# EAGLE design chip (EAGLE 6.4)
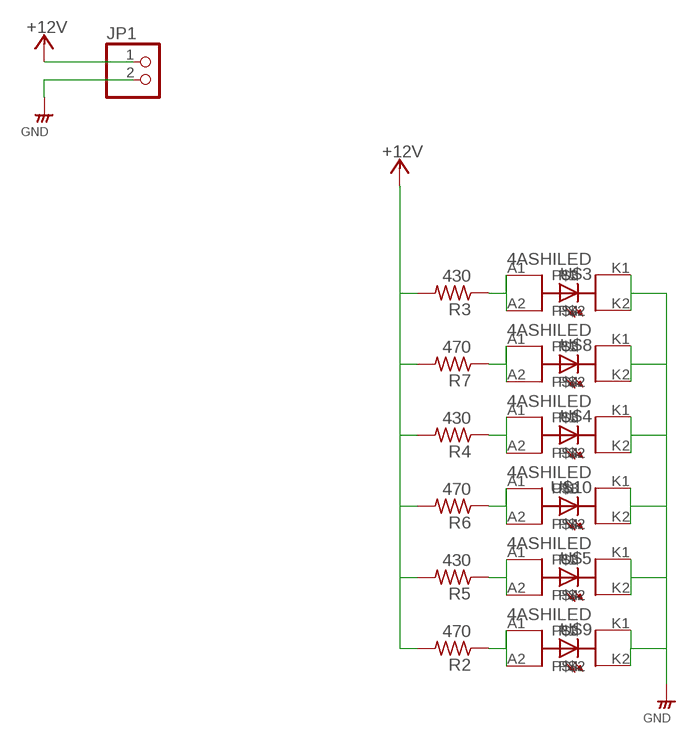
[diagram p0: schematic, sheet 1]

## Parts
JP1  PINHD-1X2"  [1*02]
R2  470  RESISTORS3216  [3216]
R3  430  RESISTORS3216  [3216]
R4  430  RESISTORS3216  [3216]
R5  430  RESISTORS3216  [3216]
R6  470  RESISTORS3216  [3216]
R7  470  RESISTORS3216  [3216]
U$3  4ASHILED  [4AHILED-KAI]
U$4  4ASHILED  [4AHILED-KAI]
U$5  4ASHILED  [4AHILED-KAI]
U$8  4ASHILED  [4AHILED-KAI]
U$9  4ASHILED  [4AHILED-KAI]
U$10  4ASHILED  [4AHILED-KAI]

## Nets
+12V: JP1.1 R2.2 R3.2 R4.2 R5.2 R6.2 R7.2
GND: JP1.2 U$3.K1 U$3.K2 U$4.K1 U$4.K2 U$5.K1 U$5.K2 U$8.K1 U$8.K2 U$9.K1 U$9.K2 U$10.K1 U$10.K2
N$1: R7.1 U$8.A1(P1) U$8.A2
N$2: R3.1 U$3.A1(P1) U$3.A2
N$4: R4.1 U$4.A1(P1) U$4.A2
N$6: R5.1 U$5.A1(P1) U$5.A2
N$7: R6.1 U$10.A1(P1) U$10.A2
N$9: R2.1 U$9.A1(P1) U$9.A2

## Library data of the parts
JP1 = pinhead_s:PINHD-1X2: PIN HEADER
R2-R7 = rcl__s:RESISTORS
U$3-U$5 U$8-U$10 = 4ashiLED-kai:4ASHILED

## Board
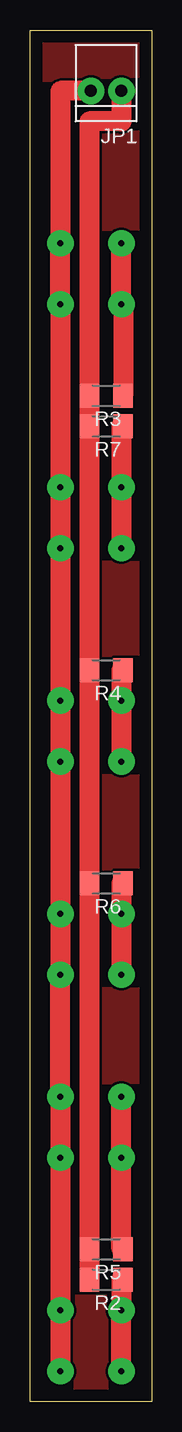
[diagram p1: board, top side]
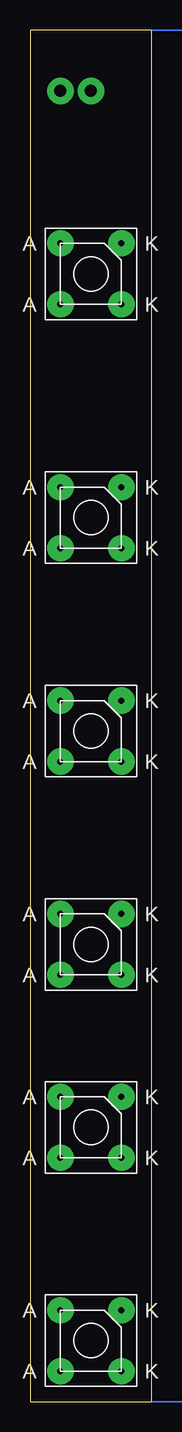
[diagram p2: board, bottom side, seen from below]

Size 10.16 x 114.3 mm. Coordinates in mm from the lower left corner, seen from the top.
Outline: 10.16,0 0,0 0,114.3 10.16,114.3 10.16,0
Copper layers (1*16): Top 0.035mm / dielectric 1.5mm / Bottom 0.035mm
Design rules "default": minimum track width 10mil, minimum drill 24mil, track to track 8mil, track to pad 8mil, pad to pad 8mil, via to via 8mil, smd to smd 8mil, copper to edge 40mil, drill to drill 8mil, minimum pad ring 10mil, minimum via ring 8mil, stop-mask expansion 4mil, vias tented up to drill 0mil, thermal gap 10mil

### Footprints (pad centres in the part's own frame; a part is rotated, then mirrored left to right if it is on the bottom)
1*02 = drill 1 pad 2.184: 1 -1.27,0; 2 1.27,0
3216 = smd 1.6 x 2: 1 -1.4,0; 2 1.4,0
4AHILED-KAI = drill 0.5 pad 2.184: A1 -2.54,2.54; A2 -2.54,-2.54; K1 2.54,2.54; K2 2.54,-2.54

### Placement (x,y rotation side)
JP1  6.35,109.22 180 top
R2  6.35,10.16 180 top
R3  6.35,83.82 180 top
R4  6.35,60.96 180 top
R5  6.35,12.7 180 top
R6  6.35,43.18 180 top
R7  6.35,81.28 180 top
U$3  5.08,93.98 0 bottom
U$4  5.08,55.88 0 bottom
U$5  5.08,22.86 0 bottom
U$8  5.08,73.66 0 bottom
U$9  5.08,5.08 0 bottom
U$10  5.08,38.1 0 bottom

### Tracks (layer width: path | path; a pad name or v marks a point on that pad's centre or on a via)
+12V
  Top 1.676: JP1.1 7.62,106.68 4.95,106.68 R3.2 R7.2 R4.2 R6.2 R5.2 R2.2
GND
  Top 1.676: JP1.2 2.54,109.22 U$3.K1 U$3.K2 U$8.K1 U$8.K2 U$4.K1 | U$4.K1 U$4.K2 | U$4.K1 U$10.K1 U$10.K2 U$5.K1 U$5.K2 U$9.K1 U$9.K2
N$1
  Top 1.676: R7.1 7.62,81.28 U$8.A1 U$8.A2
N$2
  Top 1.676: R3.1 7.75,91.44 U$3.A2 U$3.A1
N$3
  pour Top: 10.16,114.3 10.16,0 0,0 0,114.3
N$4
  Top 1.676: U$4.A2 U$4.A1 7.62,60.96 R4.1
N$6
  Top 1.676: R5.1 7.62,12.7 U$5.A2 U$5.A1
N$7
  Top 1.676: R6.1 7.62,43.18 U$10.A1 U$10.A2
N$9
  Top 1.676: R2.1 7.62,10.16 U$9.A1 U$9.A2
(copper drawn outside any net)
  shapes: Bottom area x1